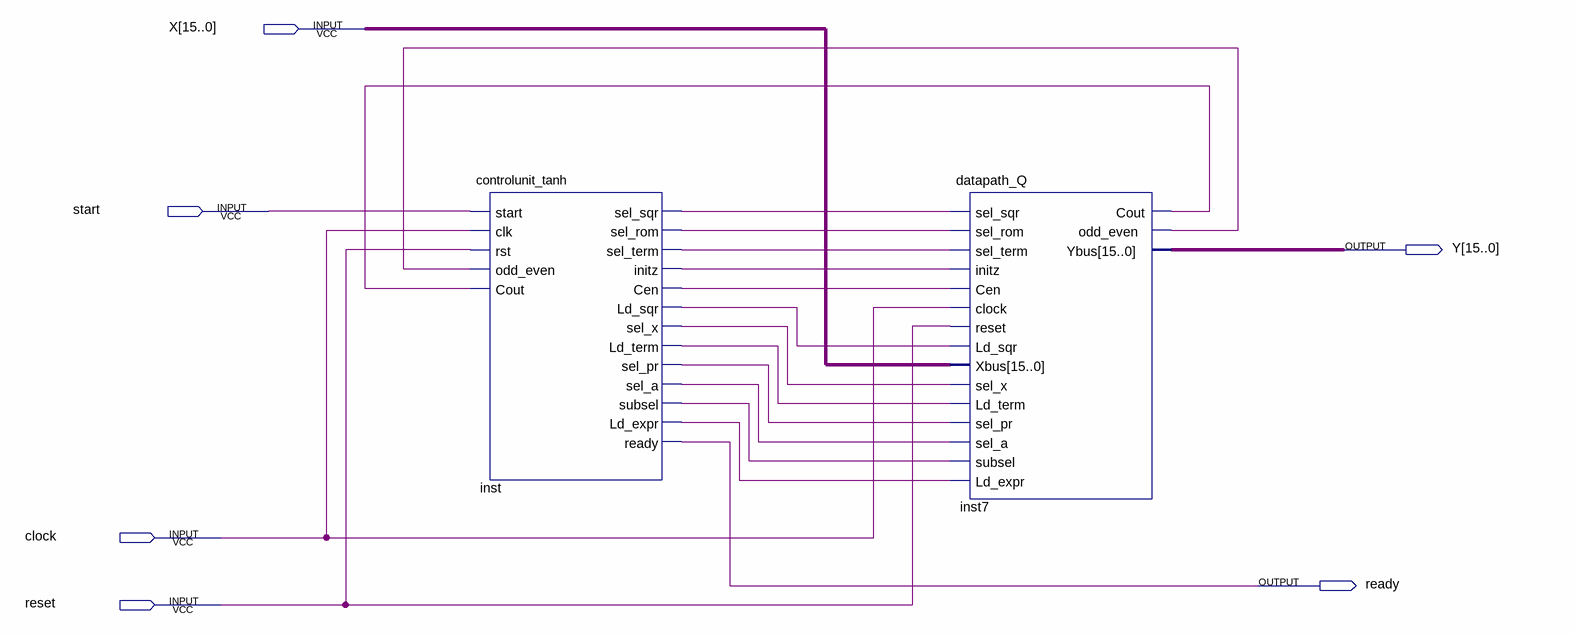
[diagram p0: schematic sheet]
// Quartus schematic CA6_Quartus.bdf as structural Verilog: 2 symbols, 6 pins
module CA6_Quartus (
  input  [15:0] X,
  input  start,
  input  clock,
  input  reset,
  output [15:0] Y,
  output ready
);

  wire inst7_cout, inst7_odd_even, inst_cen, inst_initz, inst_ld_expr, inst_ld_sqr, inst_ld_term, inst_sel_a,
       inst_sel_pr, inst_sel_rom, inst_sel_sqr, inst_sel_term, inst_sel_x, inst_subsel;

  controlunit_tanh inst (
    .start(start), .clk(clock), .rst(reset), .odd_even(inst7_odd_even), .Cout(inst7_cout),
    .sel_sqr(inst_sel_sqr), .sel_rom(inst_sel_rom), .sel_term(inst_sel_term), .initz(inst_initz),
    .Cen(inst_cen), .Ld_sqr(inst_ld_sqr), .sel_x(inst_sel_x), .Ld_term(inst_ld_term), .sel_pr(inst_sel_pr),
    .sel_a(inst_sel_a), .subsel(inst_subsel), .Ld_expr(inst_ld_expr), .ready(ready));
  datapath_Q inst7 (
    .sel_sqr(inst_sel_sqr), .sel_rom(inst_sel_rom), .sel_term(inst_sel_term), .initz(inst_initz),
    .Cen(inst_cen), .clock(clock), .reset(reset), .Ld_sqr(inst_ld_sqr), .Xbus(X), .sel_x(inst_sel_x),
    .Ld_term(inst_ld_term), .sel_pr(inst_sel_pr), .sel_a(inst_sel_a), .subsel(inst_subsel),
    .Ld_expr(inst_ld_expr), .Cout(inst7_cout), .odd_even(inst7_odd_even), .Ybus(Y));
endmodule
